# EasyEDA Pro project stiebel_eltron_bus_extension_pcb.eprj, schematic stiebel_can_sniffer
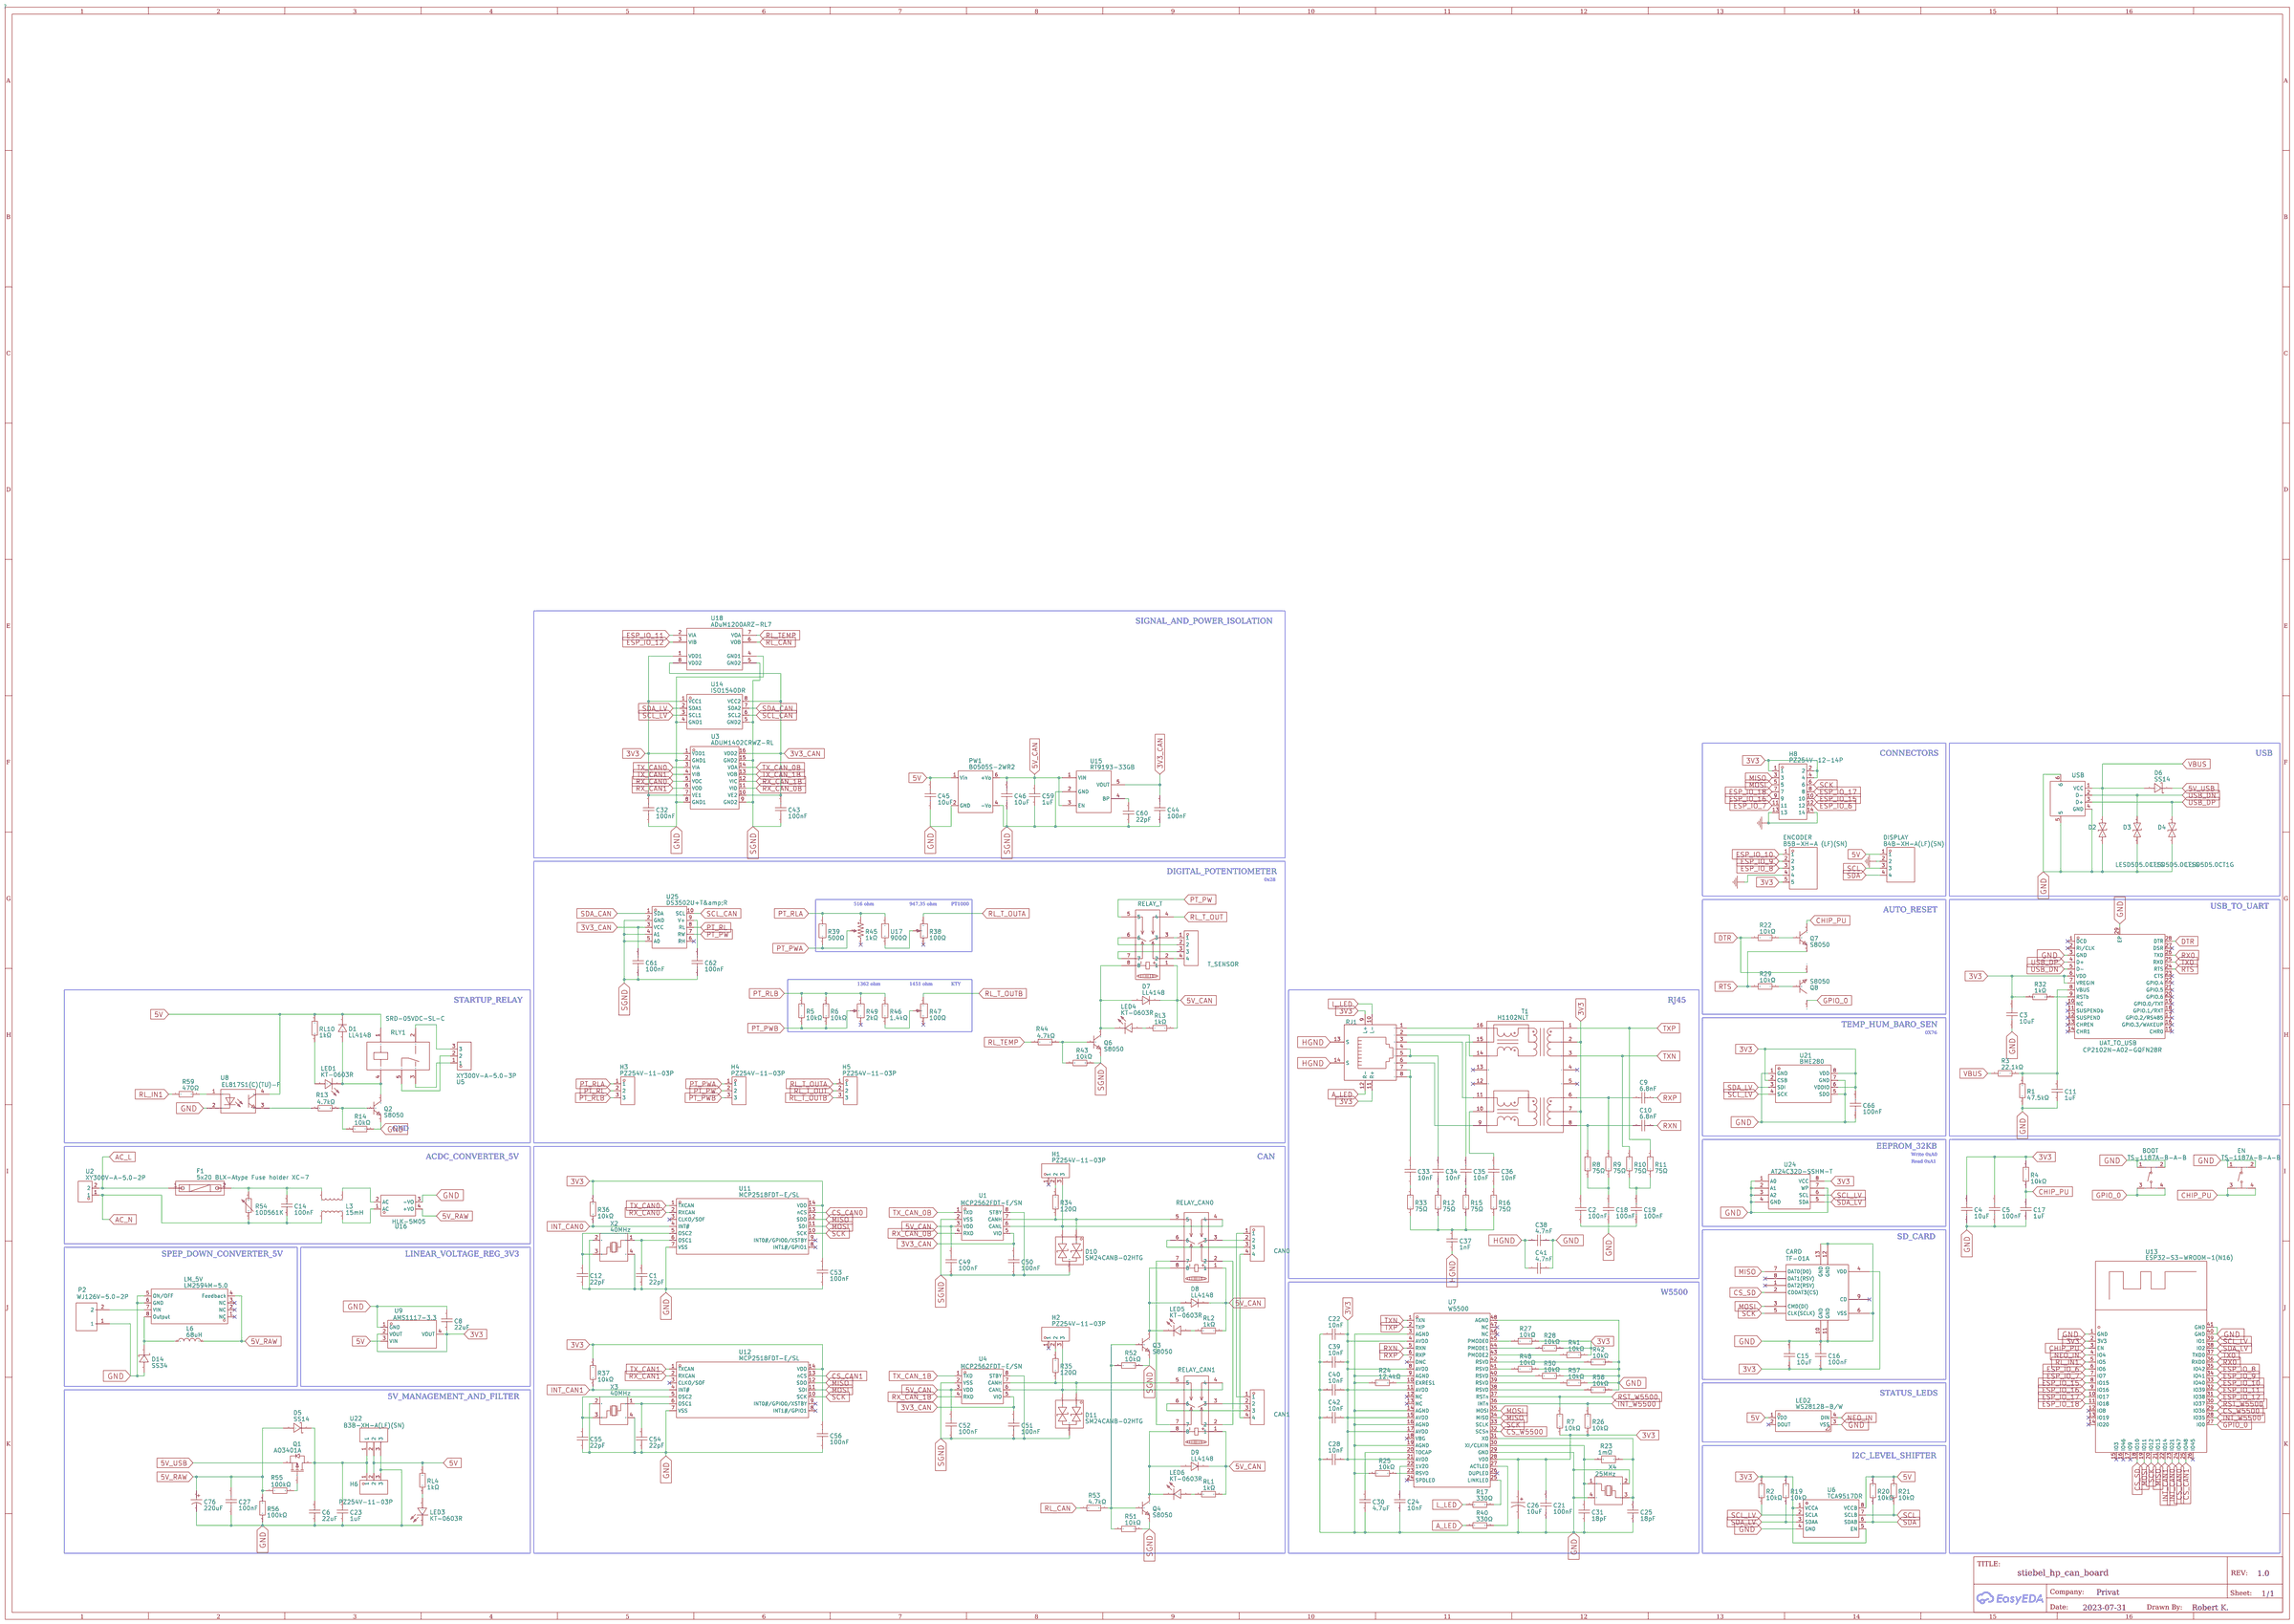
[diagram p0: schematic sheet]

## Parts
BOOT  TS-1187A-B-A-B  [SW-SMD_4P-L5.1-W5.1-P3.70-LS6.5-TL-2]
C1  22pF  [C0603]
C2  100nF  [C0603]  (no BOM)
C3  10uF  [C0603]
C4  10uF  [C0603]
C5  100nF  [C0603]
C6  22uF  [C1206]
C8  22uF  [C1206]
C9  6.8nF  [C0603]
C10  6.8nF  [C0603]
C11  1uF  [C0603]
C12  22pF  [C0603]
C14  100nF  [CAP-TH_L13.0-W6.0-P10.00-D1.2]
C15  10uF  [C0603]
C16  100nF  [C0603]
C17  1uF  [C0603]
C18  100nF  [C0603]  (no BOM)
C19  100nF  [C0603]  (no BOM)
C21  100nF  [C0603]
C22  10nF  [C0603]
C23  1uF  [C0603]
C24  10nF  [C0603]
C25  18pF  [C0603]
C26  10uF  [CAP-SMD_BD4.0-L4.3-W4.3-LS5.3-FD]
C27  100nF  [C0603]
C28  10nF  [C0603]
C30  4.7uF  [C0603]
C31  18pF  [C0603]
C32  100nF  [C0603]
C33  10nF  [C0603]
C34  10nF  [C0603]
C35  10nF  [C0603]
C36  10nF  [C0603]
C37  1nF  [C1206]
C38  4.7nF  [C1206]
C39  10nF  [C0603]
C40  10nF  [C0603]
C41  4.7nF  [C1206]
C42  10nF  [C0603]
C43  100nF  [C0603]
C44  100nF  [C0603]
C45  10uF  [C0603]
C46  10uF  [C0603]
C49  100nF  [C0603]
C50  100nF  [C0603]
C51  100nF  [C0603]
C52  100nF  [C0603]
C53  100nF  [C0603]
C54  22pF  [C0603]
C55  22pF  [C0603]
C56  100nF  [C0603]
C59  1uF  [C0603]
C60  22pF  [C0603]
C61  100nF  [C0603]
C62  100nF  [C0603]
C66  100nF  [C0603]
C76  220uF  [CAP-SMD_BD6.3-L6.6-W6.6-FD]
CAN0  DB127V-5.0-4P-GN-S  [CONN-TH_4P-P5.00_DB127V-5.0-4P-GN-S]
CAN1  DB127V-5.0-4P-GN-S  [CONN-TH_4P-P5.00_DB127V-5.0-4P-GN-S]
CARD  TF-01A  [TF-SMD_TF-01A]
D1  LL4148  [LL-34_L3.5-W1.5-RD]
D2  LESD5D5.0CT1G  [SOD-523_L1.2-W0.8-LS1.6-BI]
D3  LESD5D5.0CT1G  [SOD-523_L1.2-W0.8-LS1.6-BI]
D4  LESD5D5.0CT1G  [SOD-523_L1.2-W0.8-LS1.6-BI]
D5  SS14  [SMA_L4.2-W2.6-LS5.3-RD]
D6  SS14  [SMA_L4.2-W2.6-LS5.3-RD]
D7  LL4148  [LL-34_L3.5-W1.5-RD]
D8  LL4148  [LL-34_L3.5-W1.5-RD]
D9  LL4148  [LL-34_L3.5-W1.5-RD]
D10  SM24CANB-02HTG  [SOT-23-3_L2.9-W1.3-P1.90-LS2.4-BR]
D11  SM24CANB-02HTG  [SOT-23-3_L2.9-W1.3-P1.90-LS2.4-BR]
D14  SS34  [SMA_L4.3-W2.6-LS5.2-RD]
DISPLAY  B4B-XH-A(LF)(SN)  [CONN-TH_B4B-XH-A-LF-SN]
EN  TS-1187A-B-A-B  [SW-SMD_4P-L5.1-W5.1-P3.70-LS6.5-TL-2]
ENCODER  B5B-XH-A (LF)(SN)  [CONN-TH_B5B-XH-A-LF-SN]
F1  5x20 BLX-Atype Fuse holder XC-7  [FUSE-TH_L22.6-W9.0]
H1  PZ254V-11-03P  [HDR-TH_3P-P2.54-V-M]
H2  PZ254V-11-03P  [HDR-TH_3P-P2.54-V-M]
H3  PZ254V-11-03P  [HDR-TH_3P-P2.54-V-M]
H4  PZ254V-11-03P  [HDR-TH_3P-P2.54-V-M]
H5  PZ254V-11-03P  [HDR-TH_3P-P2.54-V-M]
H6  PZ254V-11-03P  [HDR-TH_3P-P2.54-V-M]
H8  PZ254V-12-14P  [HDR-TH_14P-P2.54-V-M-R2-C7-S2.54]
L3  15mH  [FILTER-TH_4P-L17.0-W12.0-P7.00-D0.6-S8.00]
L6  68uH  [IND-SMD_L7.1-W6.6]
LED1  KT-0603R  [LED0603-RD]
LED2  WS2812B-B/W  [LED-SMD_4P-L5.0-W5.0-TL_WS2812B-B]
LED3  KT-0603R  [LED0603-RD]
LED4  KT-0603R  [LED0603-RD]
LED5  KT-0603R  [LED0603-RD]
LED6  KT-0603R  [LED0603-RD]
LM_5V  LM2594M-5.0  [SOP-8_L4.9-W3.9-P1.27-LS6.0-BL]
P2  WJ126V-5.0-2P  [CONN-TH_WJ126V-5.0-2P]
PW1  B0505S-2WR2  [PWRM-TH_B0505S-2WR2_C2992385]
Q1  AO3401A  [SOT-23_L2.9-W1.3-P1.90-LS2.4-BR]
Q2  S8050  [SOT-23-3_L3.0-W1.7-P0.95-LS2.9-BR]
Q3  S8050  [SOT-23-3_L3.0-W1.7-P0.95-LS2.9-BR]
Q4  S8050  [SOT-23-3_L3.0-W1.7-P0.95-LS2.9-BR]
Q6  S8050  [SOT-23-3_L3.0-W1.7-P0.95-LS2.9-BR]
Q7  S8050  [SOT-23-3_L3.0-W1.7-P0.95-LS2.9-BR]
Q8  S8050  [SOT-23-3_L3.0-W1.7-P0.95-LS2.9-BR]
R1  47.5kΩ  [R0603]
R2  10kΩ  [R0603]
R3  22.1kΩ  [R0603]
R4  10kΩ  [R0603]
R5  10kΩ  [R0603]
R6  10kΩ  [R0603]
R7  10kΩ  [R0603]
R8  75Ω  [R0603]
R9  75Ω  [R0603]
R10  75Ω  [R0603]
R11  75Ω  [R0603]
R12  75Ω  [R0603]
R13  4.7kΩ  [R0603]
R14  10kΩ  [R0603]
R15  75Ω  [R0603]
R16  75Ω  [R0603]
R17  330Ω  [R0603]
R19  10kΩ  [R0603]
R20  10kΩ  [R0603]
R21  10kΩ  [R0603]
R22  10kΩ  [R0603]
R23  1mΩ  [RES-SMD_L3.2-W1.6_PA1206]
R24  12.4kΩ  [R0603]
R25  10kΩ  [R0603]
R26  10kΩ  [R0603]
R27  10kΩ  [R0603]
R28  10kΩ  [R0603]
R29  10kΩ  [R0603]
R32  1kΩ  [R0603]
R33  75Ω  [R0603]
R34  120Ω  [R0603]
R35  120Ω  [R0603]
R36  10kΩ  [R0603]
R37  10kΩ  [R0603]
R38  100Ω  [RES-ADJ-TH_3296W]
R39  500Ω  [R0805]
R40  330Ω  [R0603]
R41  10kΩ  [R0603]
R42  10kΩ  [R0603]
R43  10kΩ  [R0603]
R44  4.7kΩ  [R0603]
R45  1kΩ  [RES-ADJ-TH_3P-L10.0-W10.0-P2.50-BL-BS]
R46  1.4kΩ  [R0603]
R47  100Ω  [RES-ADJ-TH_3296W]
R48  10kΩ  [R0603]
R49  2kΩ  [RES-ADJ-TH_3P-L10.0-W10.0-P2.50-BL-BS]
R50  10kΩ  [R0603]
R51  10kΩ  [R0603]
R52  10kΩ  [R0603]
R53  4.7kΩ  [R0603]
R54  10D561K  [RES-TH_L13.0-W6.0-P7.50-D0.9-S6.00]
R55  100kΩ  [R0603]
R56  100kΩ  [R0603]
R57  10kΩ  [R0603]
R58  10kΩ  [R0603]
R59  470Ω  [R0603]
RELAY_CAN0  G6K-2F-Y-DC5  [RELAY-SMD_G6K-2F-X-XX]
RELAY_CAN1  G6K-2F-Y-DC5  [RELAY-SMD_G6K-2F-X-XX]
RELAY_T  G6K-2F-Y-DC5  [RELAY-SMD_G6K-2F-X-XX]
RJ1  R-RJ45R08P-C000  [RJ45-TH_R-RJ45R08P-C000]
RL1  1kΩ  [R0603]
RL2  1kΩ  [R0603]
RL3  1kΩ  [R0603]
RL4  1kΩ  [R0603]
RL10  1kΩ  [R0603]
RLY1  SRD-05VDC-SL-C  [RELAY-TH_SRD-XXVDC-XL-C]
T1  H1102NLT  [XFMR-SMD_H1102NLT]
T_SENSOR  DB127V-5.0-4P-GN-S  [CONN-TH_4P-P5.00_DB127V-5.0-4P-GN-S]
U1  MCP2562FDT-E/SN  [SOIC-8_L4.9-W3.9-P1.27-LS6.0-BL]
U2  XY300V-A-5.0-2P  [CONN-TH_XY300V-A-5.0-2P]
U3  ADUM1402CRWZ-RL  [SOIC-16_L10.3-W7.5-P1.27-LS10.3-TL]
U4  MCP2562FDT-E/SN  [SOIC-8_L4.9-W3.9-P1.27-LS6.0-BL]
U5  XY300V-A-5.0-3P  [CONN-TH_XY300V-A-5.0-3P]
U6  TCA9517DR  [SOIC-8_L4.9-W3.9-P1.27-LS6.0-BL]
U7  W5500  [LQFP-48_L7.0-W7.0-P0.50-LS9.0-BL]
U8  EL817S1(C)(TU)-F  [OPTO-SMD-4_L4.6-W6.5-P2.54-LS10.3-TL]
U9  AMS1117-3.3  [SOT-223-3_L6.5-W3.4-P2.30-LS7.0-BR]
U11  MCP2518FDT-E/SL  [SOIC-14_L8.7-W3.9-P1.27-LS6.0-BL]
U12  MCP2518FDT-E/SL  [SOIC-14_L8.7-W3.9-P1.27-LS6.0-BL]
U13  ESP32-S3-WROOM-1(N16)  [WIRELM-SMD_ESP32-S3-WROOM-1]
U14  ISO1540DR  [SOIC-8_L4.9-W3.9-P1.27-LS6.0-BL]
U15  RT9193-33GB  [SOT-23-5_L3.0-W1.7-P0.95-LS2.8-BL]
U16  HLK-5M05  [PWRM-TH_HLK-5M05]
U17  900Ω  [R0805]
U18  ADuM1200ARZ-RL7  [SOIC-8_L5.0-W4.0-P1.27-LS6.0-BL]
U21  BME280  [LGA-8_BME280_BL]
U22  B3B-XH-A(LF)(SN)  [CONN-TH_3P-P2.50_A2501WV2-3P]
U24  AT24C32D-SSHM-T  [SOIC-8_L5.0-W4.0-P1.27-LS6.0-BL]
U25  DS3502U+T&amp;R  [UMAX-10_L3.0-W3.0-P0.50-LS4.9-BL]
UAT_TO_USB  CP2102N-A02-GQFN28R  [QFN-28_L5.0-W5.0-P0.50-TL-EP3.3]
USB  670688000  [USB-B-TH_67068-8000]
X2  40MHz  [OSC-SMD_4P-L3.2-W2.5-BL_SIT8008BI]
X3  40MHz  [OSC-SMD_4P-L3.2-W2.5-BL_SIT8008BI]
X4  25MHz  [OSC-SMD_4P-L3.2-W2.5-BL]

## Library data of the parts
BOOT EN = TS-1187A-B-A-B: link: https://lcsc.com/eda_search?q=C318884&amp;%26type=1&amp;ref=editor; 3DModel: SW-SMD_4P-L5.2-W5.2-H1.5-LS6.4-P3.70; Supplier: LCSC; Supplier Part: C318884; Manufacturer: XKB Connectivity(中国星坤); JLCPCB Part Class: Basic Part
C1 C12 C54 C55 C60 = 22pF: link: https://lcsc.com/eda_search?q=C1653&amp;%26type=1&amp;ref=editor; 3DModel: C0603_L1.6-W0.8-H0.8; Supplier: LCSC; Manufacturer Part: CL10C220JB8NNNC; Manufacturer: SAMSUNG(三星); Supplier Part: C1653; JLCPCB Part Class: Basic Part
C2 C5 C16 C18 C19 C21 C27 C32 C43 C44 C49-C53 C56 C61 C62 = 100nF: link: https://lcsc.com/eda_search?q=C14663&amp;%26type=1&amp;ref=editor; 3DModel: C0603_L1.6-W0.8-H0.8; Supplier: LCSC; Manufacturer: YAGEO(国巨); Manufacturer Part: CC0603KRX7R9BB104; Supplier Part: C14663; JLCPCB Part Class: Basic Part
C3 C4 C15 C45 C46 = 10uF: link: https://lcsc.com/eda_search?q=C19702&amp;%26type=1&amp;ref=editor; 3DModel: C0603_L1.6-W0.8-H0.8; Supplier: LCSC; Manufacturer: SAMSUNG(三星); Manufacturer Part: CL10A106KP8NNNC; Supplier Part: C19702; JLCPCB Part Class: Basic Part
C6 C8 = 22uF: link: https://lcsc.com/eda_search?q=C12891&amp;%26type=1&amp;ref=editor; 3DModel: C1206_L3.2-W1.6-H1.3; Supplier: LCSC; Manufacturer Part: CL31A226KAHNNNE; Manufacturer: SAMSUNG(三星); Supplier Part: C12891; JLCPCB Part Class: Basic Part
C9 C10 = 6.8nF: link: https://lcsc.com/eda_search?q=C1631&amp;%26type=1&amp;ref=editor; 3DModel: C0603_L1.6-W0.8-H0.8; Supplier: LCSC; Manufacturer: FH(风华); Manufacturer Part: 0603B682K500NT; Supplier Part: C1631; JLCPCB Part Class: Basic Part
C11 C17 C23 C59 = 1uF: link: https://lcsc.com/eda_search?q=C15849&amp;%26type=1&amp;ref=editor; 3DModel: C0603_L1.6-W0.8-H0.8; Supplier: LCSC; Manufacturer Part: CL10A105KB8NNNC; Manufacturer: SAMSUNG(三星); Supplier Part: C15849; JLCPCB Part Class: Basic Part
C14 = 100nF: link: https://lcsc.com/eda_search?q=C270277&amp;%26type=1&amp;ref=editor; 3DModel: CAP-TH_L13.0-W6.0-H12.0-P10.0; Supplier: LCSC; Supplier Part: C270277; Manufacturer: CHAMPION(全鹏); Manufacturer Part: MPP104K1000D131206B1015; JLCPCB Part Class: Extended Part
C22 C24 C28 C39 C40 C42 = 10nF: link: https://lcsc.com/eda_search?q=C57112&amp;%26type=1&amp;ref=editor; 3DModel: C0603_L1.6-W0.8-H0.8; Supplier: LCSC; Manufacturer: FH(风华); Manufacturer Part: 0603B103K500NT; Supplier Part: C57112; JLCPCB Part Class: Basic Part
C25 C31 = 18pF: link: https://lcsc.com/eda_search?q=C1647&amp;%26type=1&amp;ref=editor; 3DModel: C0603_L1.6-W0.8-H0.8; Supplier: LCSC; Manufacturer Part: CL10C180JB8NNNC; Manufacturer: SAMSUNG(三星); Supplier Part: C1647; JLCPCB Part Class: Basic Part
C26 = 10uF: link: https://lcsc.com/eda_search?q=C445047&amp;%26type=1&amp;ref=editor; Supplier: LCSC; Supplier Part: C445047; Manufacturer: Nichicon(尼吉康); Manufacturer Part: UWX1C100MCL1GB; JLCPCB Part Class: Extended Part
C30 = 4.7uF: link: https://lcsc.com/eda_search?q=C19666&amp;%26type=1&amp;ref=editor; 3DModel: C0603_L1.6-W0.8-H0.8; Supplier: LCSC; Manufacturer Part: CL10A475KO8NNNC; Manufacturer: SAMSUNG(三星); Supplier Part: C19666; JLCPCB Part Class: Basic Part
C33-C36 = 10nF: link: https://lcsc.com/eda_search?q=C302008&amp;%26type=1&amp;ref=editor; 3DModel: C0603_L1.6-W0.8-H0.8; Supplier: LCSC; Supplier Part: C302008; Manufacturer: Walsin(华新科); Manufacturer Part: 0603B103K101CT; JLCPCB Part Class: Extended Part
C37 = 1nF: link: https://lcsc.com/eda_search?q=C9196&amp;%26type=1&amp;ref=editor; 3DModel: C1206_L3.2-W1.6-H1.3; Supplier: LCSC; Manufacturer: FH(风华); Manufacturer Part: 1206B102K202NT; Supplier Part: C9196; JLCPCB Part Class: Basic Part
C38 C41 = 4.7nF: link: https://lcsc.com/eda_search?q=C41017&amp;%26type=1&amp;ref=editor; 3DModel: C1206_L3.2-W1.6-H1.3; Supplier: LCSC; Manufacturer: FH(风华); Manufacturer Part: 1206B472K202NT; Supplier Part: C41017; JLCPCB Part Class: Extended Part
C66 = 100nF: link: https://lcsc.com/eda_search?q=C14663&%26type=1&ref=editor; 3DModel: C0603_L1.6-W0.8-H0.8; Supplier: LCSC; Manufacturer: YAGEO(国巨); Manufacturer Part: CC0603KRX7R9BB104; Supplier Part: C14663; JLCPCB Part Class: Basic Part
C76 = 220uF: link: https://item.szlcsc.com/265679.html; Supplier: LCSC; Supplier Part: C267466; Manufacturer: ROQANG(容强); Manufacturer Part: RT1A221M0605; JLCPCB Part Class: Extended Part
CAN0 CAN1 T_SENSOR = DB127V-5.0-4P-GN-S: link: https://lcsc.com/eda_search?q=C430624&amp;%26type=1&amp;ref=editor; Supplier: LCSC; Supplier Part: C430624; Manufacturer: DIBO(地博电气); JLCPCB Part Class: Extended Part
CARD = TF-01A: link: https://item.szlcsc.com/92334.html; 3DModel: TF-SMD_L14.8-W14.5-H1.9-P1.1; Supplier: LCSC; Manufacturer: 韩国韩荣; Supplier Part: C91145; JLCPCB Part Class: Extended Part
D1 D7-D9 = LL4148: link: https://lcsc.com/eda_search?q=C9808&amp;%26type=1&amp;ref=editor; 3DModel: LL-34_L3.5-W1.5; Supplier: LCSC; Manufacturer: ST(先科); Supplier Part: C9808; JLCPCB Part Class: Basic Part
D2-D4 = LESD5D5.0CT1G: link: https://lcsc.com/eda_search?q=C383211&amp;%26type=1&amp;ref=editor; Supplier: LCSC; Supplier Part: C383211; Manufacturer: LRC(乐山无线电); JLCPCB Part Class: Extended Part
D5 D6 = SS14: link: https://lcsc.com/eda_search?q=C2480&amp;%26type=1&amp;ref=editor; Supplier: LCSC; Manufacturer: MDD; Supplier Part: C2480; JLCPCB Part Class: Basic Part
D10 D11 = SM24CANB-02HTG: link: https://lcsc.com/eda_search?q=C151237&amp;%26type=1&amp;ref=editor; 3DModel: SOT-23-3P_L2.9-W1.3-H1.0-LS2.4-P0.95; Supplier: LCSC; Supplier Part: C151237; Manufacturer: Littelfuse(美国力特); JLCPCB Part Class: Extended Part
D14 = SS34: link: https://item.szlcsc.com/34721.html; Supplier: LCSC; Manufacturer: MDD; Supplier Part: C8678; JLCPCB Part Class: Basic Part
DISPLAY = B4B-XH-A(LF)(SN): link: https://lcsc.com/eda_search?q=C144395&amp;%26type=1&amp;ref=editor; 3DModel: XH2.5-4A; Supplier: LCSC; Supplier Part: C144395; Manufacturer: JST; JLCPCB Part Class: Extended Part
ENCODER = B5B-XH-A (LF)(SN): link: https://lcsc.com/eda_search?q=C157991&amp;%26type=1&amp;ref=editor; 3DModel: CONN-TH_XH2.50-LI-5P; Supplier: LCSC; Supplier Part: C157991; Manufacturer: JST; Manufacturer Part: B5B-XH-A(LF)(SN); JLCPCB Part Class: Extended Part
F1 = 5x20 BLX-Atype Fuse holder XC-7: link: https://lcsc.com/eda_search?q=C3131&amp;%26type=1&amp;ref=editor; Supplier: LCSC; Manufacturer Part: 5x20 BLX-A型 保险丝支架 XC-7; Manufacturer: xcfuse(旭程); Supplier Part: C3131; JLCPCB Part Class: Extended Part
H1-H6 = PZ254V-11-03P: link: https://lcsc.com/eda_search?q=C2937625&amp;%26type=1&amp;ref=editor; 3DModel: HDR-TH_3P-P2.54-M-LI-1X3P; Supplier: LCSC; Supplier Part: C2937625; Manufacturer: XFCN(兴飞); JLCPCB Part Class: Extended Part
H8 = PZ254V-12-14P: link: https://lcsc.com/eda_search?q=C492424&amp;%26type=1&amp;ref=editor; 3DModel: HDR-TH_14P-P2.54-M-LI-2X7P; Supplier: LCSC; Supplier Part: C492424; Manufacturer: XFCN(兴飞); JLCPCB Part Class: Extended Part
L3 = 15mH: link: https://lcsc.com/eda_search?q=C75194&amp;%26type=1&amp;ref=editor; 3DModel: FILTER-TH_4P-L17.0-W12.0-H16.5-P7.00-D0.6-S8.00; Supplier: LCSC; Manufacturer: FH(风华); Manufacturer Part: UU9.8-15mH; Supplier Part: C75194; JLCPCB Part Class: Extended Part
L6 = 68uH: link: https://item.szlcsc.com/421431.html; 3DModel: IND-SMD_L6.6-W7.1-H3.0; Supplier: LCSC; Supplier Part: C2894721; Manufacturer: SXN(顺翔诺); Manufacturer Part: SMMS0650-680M; JLCPCB Part Class: Extended Part
LED1 LED3-LED6 = KT-0603R: link: https://lcsc.com/eda_search?q=C2286&amp;%26type=1&amp;ref=editor; Supplier: LCSC; Manufacturer: KENTO; Supplier Part: C2286; JLCPCB Part Class: Basic Part
LED2 = WS2812B-B/W: link: https://lcsc.com/eda_search?q=C2761795&amp;%26type=1&amp;ref=editor; 3DModel: LED-SMD_4P-L5.0-W5.0-H1.57-TL_WS2812B-B; Supplier: LCSC; Supplier Part: C2761795; Manufacturer: worldsemi; Manufacturer Part: WS2812B-B/T; JLCPCB Part Class: Extended Part
LM_5V = LM2594M-5.0: link: https://item.szlcsc.com/383602.html; 3DModel: SOP-8_L4.9-W3.9-P1.27-LS6.0-BL-1; Supplier: LCSC; Supplier Part: C2904795; Manufacturer: UMW(广东友台半导体); JLCPCB Part Class: Extended Part
P2 = WJ126V-5.0-2P: link: https://lcsc.com/eda_search?q=C8404&amp;%26type=1&amp;ref=editor; 3DModel: CONN-TH_DB5.00-LI-2P-126; Supplier: LCSC; Manufacturer: KANGNEX(康奈克斯电气); Supplier Part: C8404; JLCPCB Part Class: Extended Part
PW1 = B0505S-2WR2: link: https://lcsc.com/eda_search?q=C2992385&amp;%26type=1&amp;ref=editor; Supplier: LCSC; Supplier Part: C2992385; Manufacturer: YLPTEC(易川); JLCPCB Part Class: Extended Part
Q1 = AO3401A: link: https://lcsc.com/eda_search?q=C15127&amp;%26type=1&amp;ref=editor; 3DModel: SOT-23-3P_L2.9-W1.3-H1.0-LS2.4-P0.95; Supplier: LCSC; Manufacturer: AOS; Supplier Part: C15127; JLCPCB Part Class: Basic Part
Q2-Q4 Q6-Q8 = S8050: link: https://lcsc.com/eda_search?q=C2146&amp;%26type=1&amp;ref=editor; 3DModel: SOT-23-3L_L2.9-W1.6-H1.1-LS2.8-P0.95; Supplier: LCSC; Manufacturer: CJ(江苏长电/长晶); Manufacturer Part: S8050 J3Y; Supplier Part: C2146; JLCPCB Part Class: Basic Part
R1 = 47.5kΩ: link: https://lcsc.com/eda_search?q=C23061&amp;%26type=1&amp;ref=editor; Supplier: LCSC; Manufacturer: UNI-ROYAL(厚声); Manufacturer Part: 0603WAF4752T5E; Supplier Part: C23061; JLCPCB Part Class: Extended Part
R2 R4-R7 R19-R22 R25-R29 R36 R37 R41 R42 R48 R50 R57 R58 = 10kΩ: link: https://lcsc.com/eda_search?q=C25804&amp;%26type=1&amp;ref=editor; Supplier: LCSC; Manufacturer: UNI-ROYAL(厚声); Manufacturer Part: 0603WAF1002T5E; Supplier Part: C25804; JLCPCB Part Class: Basic Part
R3 = 22.1kΩ: link: https://lcsc.com/eda_search?q=C25961&amp;%26type=1&amp;ref=editor; Supplier: LCSC; Manufacturer: UNI-ROYAL(厚声); Manufacturer Part: 0603WAF2212T5E; Supplier Part: C25961; JLCPCB Part Class: Extended Part
R8-R12 R15 R16 R33 = 75Ω: link: https://lcsc.com/eda_search?q=C4275&amp;%26type=1&amp;ref=editor; Supplier: LCSC; Manufacturer: UNI-ROYAL(厚声); Manufacturer Part: 0603WAF750JT5E; Supplier Part: C4275; JLCPCB Part Class: Basic Part
R13 R44 R53 = 4.7kΩ: link: https://www.mouser.in/datasheet/2/447/PYu_RT_1_to_0_01_RoHS_L_11-1669912.pdf; Supplier: LCSC; Manufacturer: UNI-ROYAL(厚声); Manufacturer Part: 0603WAF4701T5E; Supplier Part: C23162; Resistance: 4.7K; JLCPCB Part Class: Basic Part
R14 R43 R51 R52 = 10kΩ: link: https://lcsc.com/eda_search?q=C25804&%26type=1&ref=editor; Supplier: LCSC; Manufacturer: UNI-ROYAL(厚声); Manufacturer Part: 0603WAF1002T5E; Supplier Part: C25804; JLCPCB Part Class: Basic Part
R17 R40 = 330Ω: link: https://lcsc.com/eda_search?q=C23138&amp;%26type=1&amp;ref=editor; Supplier: LCSC; Manufacturer: UNI-ROYAL(厚声); Manufacturer Part: 0603WAF3300T5E; Supplier Part: C23138; JLCPCB Part Class: Basic Part
R23 = 1mΩ: link: https://lcsc.com/eda_search?q=C914835&amp;%26type=1&amp;ref=editor; Supplier: LCSC; Supplier Part: C914835; Manufacturer: YAGEO(国巨); Manufacturer Part: PA1206FRF470R001Z; JLCPCB Part Class: Extended Part
R24 = 12.4kΩ: link: https://lcsc.com/eda_search?q=C22865&amp;%26type=1&amp;ref=editor; Supplier: LCSC; Manufacturer: UNI-ROYAL(厚声); Manufacturer Part: 0603WAF1242T5E; Supplier Part: C22865; JLCPCB Part Class: Extended Part
R32 = 1kΩ: link: https://lcsc.com/eda_search?q=C21190&amp;%26type=1&amp;ref=editor; Supplier: LCSC; Manufacturer: UNI-ROYAL(厚声); Manufacturer Part: 0603WAF1001T5E; Supplier Part: C21190; JLCPCB Part Class: Basic Part
R34 R35 = 120Ω: link: https://lcsc.com/eda_search?q=C22787&amp;%26type=1&amp;ref=editor; Supplier: LCSC; Manufacturer: UNI-ROYAL(厚声); Manufacturer Part: 0603WAF1200T5E; Supplier Part: C22787; JLCPCB Part Class: Basic Part
R38 R47 = 100Ω: link: https://lcsc.com/eda_search?q=C83688&amp;%26type=1&amp;ref=editor; Resistance: 100; Supplier: LCSC; Manufacturer: BOURNS; Manufacturer Part: 3296W-1-101LF; Supplier Part: C83688; JLCPCB Part Class: Extended Part
R39 = 500Ω: link: https://lcsc.com/eda_search?q=C2828857&amp;%26type=1&amp;ref=editor; 3DModel: R0805_L2.0-W1.3-H0.6; Supplier: LCSC; Supplier Part: C2828857; Manufacturer: Viking(光颉); Manufacturer Part: ARG05FTC5000; JLCPCB Part Class: Extended Part
R45 = 1kΩ: link: https://lcsc.com/eda_search?q=C118949&amp;%26type=1&amp;ref=editor; 3DModel: 3296W; Resistance: 1K; Supplier: LCSC; Supplier Part: C118949; Manufacturer: BOCHEN(博晨); Manufacturer Part: 3296W-1-102; JLCPCB Part Class: Extended Part
R46 = 1.4kΩ: link: https://lcsc.com/eda_search?q=C185359&amp;%26type=1&amp;ref=editor; Supplier: LCSC; Supplier Part: C185359; Manufacturer: YAGEO(国巨); Manufacturer Part: RC0603FR-071K4L; JLCPCB Part Class: Extended Part
R49 = 2kΩ: link: https://lcsc.com/eda_search?q=C118206&amp;%26type=1&amp;ref=editor; 3DModel: 3296W; Resistance: 2K; Supplier: LCSC; Manufacturer: BOCHEN(博晨); Manufacturer Part: 3296W-1-202; Supplier Part: C118206; JLCPCB Part Class: Extended Part
R54 = 10D561K: link: https://lcsc.com/eda_search?q=C113236&amp;%26type=1&amp;ref=editor; 3DModel: RES-TH_L12.0-W6.0-H15.0-P7.50-D0.8-S6.00; Supplier: LCSC; Manufacturer: HEL(鸿志); Supplier Part: C113236; JLCPCB Part Class: Extended Part
R55 R56 = 100kΩ: link: https://lcsc.com/eda_search?q=C25803&amp;%26type=1&amp;ref=editor; Supplier: LCSC; Manufacturer: UNI-ROYAL(厚声); Manufacturer Part: 0603WAF1003T5E; Supplier Part: C25803; JLCPCB Part Class: Basic Part
R59 = 470Ω: link: https://lcsc.com/eda_search?q=C23179&amp;%26type=1&amp;ref=editor; Supplier: LCSC; Manufacturer: UNI-ROYAL(厚声); Manufacturer Part: 0603WAF4700T5E; Supplier Part: C23179; JLCPCB Part Class: Basic Part
RELAY_CAN0 RELAY_CAN1 RELAY_T = G6K-2F-Y-DC5: link: https://lcsc.com/eda_search?q=C47190&amp;%26type=1&amp;ref=editor; 3DModel: SMD-8_L10.0-W6.5-H5.4-LS7.8-P2.2-3.2; Supplier: LCSC; Manufacturer: OMRON(欧姆龙); Manufacturer Part: G6K-2F-Y-TR DC5; Supplier Part: C47190; JLCPCB Part Class: Extended Part
RJ1 = R-RJ45R08P-C000: link: https://lcsc.com/eda_search?q=C386757&amp;%26type=1&amp;ref=editor; 3DModel: RJ45-TH_L16.3-W15.8-H13.1; Supplier: LCSC; Supplier Part: C386757; Manufacturer: Ckmtw(灿科盟); JLCPCB Part Class: Extended Part
RL1-RL4 RL10 = 1kΩ: link: https://lcsc.com/eda_search?q=C21190&%26type=1&ref=editor; Supplier: LCSC; Manufacturer: UNI-ROYAL(厚声); Manufacturer Part: 0603WAF1001T5E; Supplier Part: C21190; JLCPCB Part Class: Basic Part
RLY1 = SRD-05VDC-SL-C: link: https://item.szlcsc.com/31188.html; 3DModel: RELAY-TH_L19.2-W15.6-H15.8; Supplier: LCSC; Manufacturer: 松乐; Supplier Part: C35449; JLCPCB Part Class: Extended Part
T1 = H1102NLT: link: https://lcsc.com/eda_search?q=C18584&amp;%26type=1&amp;ref=editor; 3DModel: XFMR-SMD_L12.7-W7.1-H6.4-LS9.5-P1.27; Supplier: LCSC; Manufacturer: PULSE; Supplier Part: C18584; JLCPCB Part Class: Extended Part
U1 U4 = MCP2562FDT-E/SN: 3DModel: SOIC-8_L4.9-W3.9-H1.7-LS6.0-P1.27; link: https://lcsc.com/eda_search?q=C511335&amp;%26type=1&amp;ref=editor; Supplier: LCSC; Supplier Part: C511335; Manufacturer: MICROCHIP(美国微芯); JLCPCB Part Class: Extended Part
U2 = XY300V-A-5.0-2P: link: https://lcsc.com/eda_search?q=C557648&amp;%26type=1&amp;ref=editor; Supplier: LCSC; Supplier Part: C557648; Manufacturer: XINLAIYA(新莱亚); JLCPCB Part Class: Extended Part
U3 = ADUM1402CRWZ-RL: link: https://lcsc.com/eda_search?q=C403649&amp;%26type=1&amp;ref=editor; 3DModel: SOIC-16_L10.3-W7.5-H2.7-LS10.3-P1.27; Supplier: LCSC; Supplier Part: C403649; Manufacturer: ADI(亚德诺)/LINEAR(凌特); JLCPCB Part Class: Extended Part
U5 = XY300V-A-5.0-3P: link: https://lcsc.com/eda_search?q=C880594&amp;%26type=1&amp;ref=editor; Supplier: LCSC; Supplier Part: C880594; Manufacturer: XINLAIYA(新莱亚); JLCPCB Part Class: Extended Part
U6 = TCA9517DR: 3DModel: SOIC-8_L4.9-W3.9-H1.7-LS6.0-P1.27; link: https://so.szlcsc.com/global.html?c=&k=C9843; Supplier: LCSC; Manufacturer: TI(德州仪器); Supplier Part: C182421; JLCPCB Part Class: Extended Part
U7 = W5500: link: https://lcsc.com/eda_search?q=C32843&amp;%26type=1&amp;ref=editor; Supplier Part: C32843; Supplier: LCSC; 3DModel: LQFP-48_L7.0-W7.0-H1.4-LS9.0-P0.50; Manufacturer: WIZNET; JLCPCB Part Class: Extended Part
U8 = EL817S1(C)(TU)-F: link: https://lcsc.com/eda_search?q=C106900&amp;%26type=1&amp;ref=editor; 3DModel: OPTO-SMD-4_L4.6-W6.5-H3.6-LS10.2-P2.54; Supplier: LCSC; Manufacturer: EVERLIGHT(亿光); Supplier Part: C106900; JLCPCB Part Class: Basic Part
U9 = AMS1117-3.3: link: https://lcsc.com/eda_search?q=C6186&amp;%26type=1&amp;ref=editor; 3DModel: SOT-223-4P_L6.5-W3.5-H1.6-LS7.0-P2.30; Supplier: LCSC; Manufacturer: AMS; Supplier Part: C6186; JLCPCB Part Class: Basic Part
U11 U12 = MCP2518FDT-E/SL: link: https://lcsc.com/eda_search?q=C626758&amp;%26type=1&amp;ref=editor; 3DModel: SOIC-14_L8.6-W3.9-H1.8-LS6.0-P1.27; Supplier: LCSC; Supplier Part: C626758; Manufacturer: MICROCHIP(美国微芯); JLCPCB Part Class: Extended Part
U13 = ESP32-S3-WROOM-1(N16): link: https://atta.szlcsc.com/upload/public/pdf/source/20220628/A2AC12B3C87735CAEB7EBE2DBE80936C.pdf; Supplier: LCSC; Supplier Part: C2913199; Manufacturer: ESPRESSIF(乐鑫); Manufacturer Part: ESP32-S3-WROOM-1-N16; JLCPCB Part Class: Extended Part
U14 = ISO1540DR: 3DModel: SOIC-8_L4.9-W3.9-H1.7-LS6.0-P1.27; link: https://lcsc.com/eda_search?q=C179739&amp;%26type=1&amp;ref=editor; Supplier: LCSC; Manufacturer: TI(德州仪器); Supplier Part: C179739; JLCPCB Part Class: Extended Part
U15 = RT9193-33GB: link: https://lcsc.com/eda_search?q=C15651&amp;%26type=1&amp;ref=editor; 3DModel: SOT-23-5_L2.9-W1.6-H1.1-LS2.8-P0.95; Supplier: LCSC; Manufacturer: RICHTEK(立锜); Supplier Part: C15651; JLCPCB Part Class: Extended Part
U16 = HLK-5M05: link: https://lcsc.com/eda_search?q=C209907&amp;%26type=1&amp;ref=editor; Supplier: LCSC; Supplier Part: C209907; Manufacturer: HI-LINK(海凌科); JLCPCB Part Class: Extended Part
U17 = 900Ω: link: https://lcsc.com/eda_search?q=C2828704&amp;%26type=1&amp;ref=editor; 3DModel: R0805_L2.0-W1.3-H0.6; Supplier: LCSC; Supplier Part: C2828704; Manufacturer: Viking(光颉); Manufacturer Part: ARG05BTC9000N; JLCPCB Part Class: Extended Part
U18 = ADuM1200ARZ-RL7: link: https://lcsc.com/eda_search?q=C15219&amp;%26type=1&amp;ref=editor; 3DModel: SOIC-8_L4.9-W3.9-H1.7-LS6.0-P1.27; Supplier: LCSC; Manufacturer: ADI(亚德诺)/LINEAR(凌特); Supplier Part: C15219; JLCPCB Part Class: Extended Part
U21 = BME280: link: https://item.szlcsc.com/93682.html; 3DModel: LGA-8_L2.5-W2.5-H0.9-P0.65; Supplier: LCSC; Manufacturer: Bosch(博世); Supplier Part: C92489; JLCPCB Part Class: Extended Part
U22 = B3B-XH-A(LF)(SN): link: https://lcsc.com/eda_search?q=C144394&amp;%26type=1&amp;ref=editor; Supplier: LCSC; Supplier Part: C144394; Manufacturer: JST; JLCPCB Part Class: Extended Part
U24 = AT24C32D-SSHM-T: link: https://item.szlcsc.com/417287.html; 3DModel: SOIC-8_L4.9-W3.9-H1.7-LS6.0-P1.27; Supplier: LCSC; Manufacturer: MICROCHIP; Supplier Part: C60583; JLCPCB Part Class: Extended Part
U25 = DS3502U+T&R: link: https://item.szlcsc.com/1634596.html; Supplier: LCSC; Supplier Part: C2649363; Manufacturer: MAXIM(美信); JLCPCB Part Class: Extended Part
UAT_TO_USB = CP2102N-A02-GQFN28R: link: https://lcsc.com/eda_search?q=C964632&amp;%26type=1&amp;ref=editor; 3DModel: QFN-28_L5.0-W5.0-H0.9-P0.50; Supplier: LCSC; Supplier Part: C964632; Manufacturer: SILICON LABS(芯科); JLCPCB Part Class: Extended Part
USB = 670688000: link: https://lcsc.com/eda_search?q=C114097&amp;%26type=1&amp;ref=editor; Supplier: LCSC; Supplier Part: C114097; Manufacturer: MOLEX; JLCPCB Part Class: Extended Part
X2 X3 = 40MHz: link: https://lcsc.com/eda_search?q=C9010&amp;%26type=1&amp;ref=editor; 3DModel: OSC-SMD_4P-L3.2-W2.5-H1.0; Supplier: LCSC; Manufacturer: YXC(扬兴晶振); Manufacturer Part: X322540MPB4SI; Supplier Part: C9010; JLCPCB Part Class: Extended Part
X4 = 25MHz: link: https://lcsc.com/eda_search?q=C9006&amp;%26type=1&amp;ref=editor; 3DModel: OSC-SMD_4P-L3.2-W2.5-H1.0; Supplier: LCSC; Manufacturer: YXC(扬兴晶振); Manufacturer Part: X322525MOB4SI; Supplier Part: C9006; JLCPCB Part Class: Basic Part

## Nets
3V3: C2.2 C3.2 C4.2 C5.2 C8.2 C15.1 C16.1 C21.2 C22.1 C26.1 C28.1 C32.2 C39.1 C40.1 C42.1 C53.2 C56.2 C66.2 CARD.4(VDD) ENCODER.5 H8.1 H8.2 H8.4 R2.2 R4.1 R7.1 R19.2 R26.1 R27.1 R28.1 R32.2 R36.2 R37.2 R41.1 RJ1.9(L+) RJ1.11(R+) T1.2 T1.7 U3.1(VDD1) U3.7(VE1) U6.1(VCCA) U6.5(EN) U7.4(AVDD) U7.8(AVDD) U7.11(AVDD) U7.15(AVDD) U7.17(AVDD) U7.21(AVDD) U7.28(VDD) U9.2(VOUT) U9.4(VOUT) U11.14(VDD) U12.14(VDD) U13.2(3V3) U14.1(VCC1) U18.1(VDD1) U21.2(CSB) U21.6(VDDIO) U21.8(VDD) U24.8(VCC) UAT_TO_USB.6(VDD) UAT_TO_USB.7(VREGIN)
3V3_CAN: C43.2 C44.2 C50.2 C51.2 C61.2 U1.5(VIO) U3.10(VE2) U3.16(VDD2) U4.5(VIO) U14.8(VCC2) U15.5(VOUT) U18.8(VDD2) U25.3(VCC)
5V: C45.2 D1.1(K) DISPLAY.1 H6.2 LED2.1(VDD) PW1.1(Vin) R20.2 R21.2 RL4.1 RL10.2 RLY1.1 U6.8(VCCB) U8.4(COL) U9.3(VIN) U22.2
5V_CAN: C46.2 C49.2 C52.2 C59.2 D7.1(K) D8.1(K) D9.1(K) PW1.6(+Vo) RELAY_CAN0.1 RELAY_CAN1.1 RELAY_T.1 RL1.1 RL2.1 RL3.1 U1.3(VDD) U4.3(VDD) U15.1(VIN) U15.3(EN)
5V_RAW: C27.2 C76.1 D5.2(A) L6.1 LM_5V.4(Feedback) R55.1 R56.2 U16.4(+VO)
5V_USB: D6.1(K) Q1.2(S)
GND: BOOT.1(A) BOOT.2(B) C1.1 C3.1 C4.1 C5.1 C6.1 C8.1 C11.1 C12.1 C15.2 C16.2 C17.1 C18.1 C21.1 C22.2 C23.1 C24.2 C25.1 C26.2 C27.1 C28.2 C30.1 C31.1 C32.1 C38.2 C39.2 C40.2 C41.2 C42.2 C45.1 C53.1 C54.1 C55.1 C56.1 C66.1 C76.2 CARD.6(VSS) CARD.10(GND) CARD.11(GND) CARD.12(GND) CARD.13(GND) D2.1 D3.1 D4.1 D14.2(A) DISPLAY.2 EN.1(A) EN.2(B) ENCODER.4 H6.3 H8.13 H8.14 LED2.3(VSS) LED3.1(K) LM_5V.5(ON/OFF) LM_5V.6(GND) P2.1 PW1.2(GND) Q2.2(E) R1.1 R14.1 R24.1 R25.1 R42.1 R48.1 R50.1 R56.1 R57.1 R58.1 U3.2(GND1) U3.8(GND1) U6.4(GND) U7.3(AGND) U7.9(AGND) U7.14(AGND) U7.16(AGND) U7.19(AGND) U7.29(GND) U7.48(AGND) U8.2(CAT) U9.1(GND) U11.7(VSS) U12.7(VSS) U13.1(GND) U13.40(GND) U13.41(GND) U14.4(GND1) U16.3(-VO) U18.4(GND1) U21.1(GND) U21.5(SDO) U21.7(GND) U22.3 U24.1(A0) U24.2(A1) U24.3(A2) U24.4(GND) U24.7(WP) UAT_TO_USB.3(GND) UAT_TO_USB.29(EP) USB.4(GND) USB.5 USB.6 X2.2(GND) X2.4(GND) X3.2(GND) X3.4(GND) X4.2(GND) X4.4(GND)
SGND: C43.1 C44.1 C46.1 C49.1 C50.1 C51.1 C52.1 C59.1 C60.1 C61.1 C62.1 D10.3 D11.3 PW1.4(-Vo) Q3.2(E) Q4.2(E) Q6.2(E) R43.1 R51.1 R52.1 U1.2(VSS) U1.8(STBY) U3.9(GND2) U3.15(GND2) U4.2(VSS) U4.8(STBY) U14.5(GND2) U15.2(GND) U18.5(GND2) U25.2(GND) U25.4(A1) U25.5(A0)
VBUS: D2.2 D6.2(A) R3.1 USB.1(VCC)
A_LED: R40.1 RJ1.12(R-)
AC_L: F1.1 U2.2
AC_N: C14.1 L3.2 R54.1 U2.1
CHIP_PU: C17.2 EN.3(C) EN.4(D) Q7.3(C) R4.2 U13.3(EN)
CS_CAN0: U11.13(nCS) U13.24(IO47)
CS_CAN1: U12.13(nCS) U13.25(IO48)
CS_SD: CARD.2(CDDAT3(CS)) U13.18(IO10)
CS_W5500: U7.32(SCSn) U13.29(IO36)
DTR: Q8.2(E) R22.2 UAT_TO_USB.28(DTR)
ESP_IO_6: H8.12 U13.6(IO6)
ESP_IO_7: H8.11 U13.7(IO7)
ESP_IO_8: ENCODER.3 U13.35(IO42)
ESP_IO_9: ENCODER.2 U13.34(IO41)
ESP_IO_10: ENCODER.1 U13.33(IO40)
ESP_IO_11: U13.32(IO39) U18.2(VIA)
ESP_IO_12: U13.31(IO38) U18.3(VIB)
ESP_IO_15: H8.10 U13.8(IO15)
ESP_IO_16: H8.9 U13.9(IO16)
ESP_IO_17: H8.8 U13.10(IO17)
ESP_IO_18: H8.7 U13.11(IO18)
GPIO_0: BOOT.3(C) BOOT.4(D) Q8.3(C) U13.27(IO0)
HGND: C37.1 C38.1 C41.1 RJ1.13(S) RJ1.14(S)
INT_CAN0: R36.1 U11.4(INT#) U13.23(IO21)
INT_CAN1: R37.1 U12.4(INT#) U13.22(IO14)
INT_W5500: R26.2 U7.36(INTn) U13.28(IO35)
L_LED: R17.1 RJ1.10(L-)
MISO: CARD.7(DAT0(D0)) H8.3 U7.34(MISO) U11.12(SDO) U12.12(SDO) U13.21(IO13)
MOSI: CARD.3(CMD(DI)) H8.5 U7.35(MOSI) U11.11(SDI) U12.11(SDI) U13.19(IO11)
NEO_IN: LED2.4(DIN) U13.4(IO4)
PT_PW: H4.2 RELAY_T.5 U25.7(RW)
PT_PWA: H4.1 R39.1 R45.2
PT_PWB: H4.3 R5.1 R6.1 R49.2
PT_RL: H3.2 U25.8(RL)
PT_RLA: H3.1 R39.2 R45.1 U17.1
PT_RLB: H3.3 R5.2 R6.2 R46.2 R49.1
RL_CAN: R53.1 U18.6(VOB)
RL_IN1: R59.1 U13.5(IO5)
RL_T_OUT: H5.2 RELAY_T.4
RL_T_OUTA: H5.1 R38.1
RL_T_OUTB: H5.3 R47.1
RL_TEMP: R44.1 U18.7(VOA)
RST_W5500: R7.2 U7.37(RSTn) U13.30(IO37)
RTS: Q7.2(E) R29.2 UAT_TO_USB.24(RTS)
RX0: U13.36(RXD0) UAT_TO_USB.26(TXD)
RX_CAN0: U3.5(VOC) U11.2(RXCAN)
RX_CAN1: U3.6(VOD) U12.2(RXCAN)
RX_CAN_0B: U1.4(RXD) U3.11(VID)
RX_CAN_1B: U3.12(VIC) U4.4(RXD)
RXN: C10.2 U7.5(RXN)
RXP: C9.2 U7.6(RXP)
SCK: CARD.5(CLK(SCLK)) H8.6 U7.33(SCLK) U11.10(SCK) U12.10(SCK) U13.20(IO12)
SCL: DISPLAY.3 R21.1 U6.7(SCLB)
SCL_CAN: U14.6(SCL2) U25.10(SCL)
SCL_LV: R2.1 U6.2(SCLA) U13.39(IO1) U14.3(SCL1) U21.4(SCK) U24.6(SCL)
SDA: DISPLAY.4 R20.1 U6.6(SDAB)
SDA_CAN: U14.7(SDA2) U25.1(SDA)
SDA_LV: R19.1 U6.3(SDAA) U13.38(IO2) U14.2(SDA1) U21.3(SDI) U24.5(SDA)
TX0: U13.37(TXD0) UAT_TO_USB.25(RXD)
TX_CAN0: U3.3(VIA) U11.1(TXCAN)
TX_CAN1: U3.4(VIB) U12.1(TXCAN)
TX_CAN_0B: U1.1(TXD) U3.14(VOA)
TX_CAN_1B: U3.13(VOB) U4.1(TXD)
TXN: R10.2 T1.3 U7.1(TXN)
TXP: R11.2 T1.1 U7.2(TXP)
USB_DN: D3.2 UAT_TO_USB.5(D-) USB.2(D-)
USB_DP: D4.2 UAT_TO_USB.4(D+) USB.3(D+)
C6_2: C6.2 C23.2 D5.1(K) H6.1 Q1.3(D) U22.1
C33_1: C33.1 R33.2
C34_1: C34.1 R12.2
C35_1: C35.1 R15.2
C36_1: C36.1 R16.2
C37_2: C37.2 R12.1 R15.1 R16.1 R33.1
CAN0_1: CAN0.1 CAN1.1
CAN0_2: CAN0.2 RELAY_CAN0.3
CAN0_3: CAN0.3 RELAY_CAN0.6
CAN0_4: CAN0.4 CAN1.4
CAN1_2: CAN1.2 RELAY_CAN1.3
CAN1_3: CAN1.3 RELAY_CAN1.6
H1_2: H1.2 R34.2
LM_5V_7: LM_5V.7(VIN) P2.2
LM_5V_8: D14.1(K) L6.2 LM_5V.8(Output)
Net-(C2-1): C2.1 C19.1
Net-(C18-2): C18.2 R8.1 R9.1
Net-(C19-2): C19.2 R10.1 R11.1
R13_1: R13.1 U8.3(EM)
R14_2: Q2.1(B) R13.2 R14.2
R22_1: Q7.1(B) R22.1
R29_1: Q8.1(B) R29.1
R35_2: H2.2 R35.2
R43_2: Q6.1(B) R43.2 R44.2
R46_1: R46.1 R47.2
R51_2: Q3.1(B) Q4.1(B) R51.2 R52.2 R53.2
R54_2: C14.2 F1.2 L3.3 R54.2
R55_2: Q1.1(G) R55.2
RELAY_CAN0_2: RELAY_CAN0.2 RELAY_CAN1.2
RELAY_CAN0_4: D10.2 H1.3 RELAY_CAN0.4 U1.6(CANL)
RELAY_CAN0_5: D10.1 R34.1 RELAY_CAN0.5 U1.7(CANH)
RELAY_CAN0_7: RELAY_CAN0.7 RELAY_CAN1.7
RELAY_CAN0_8: D8.2(A) LED5.1(K) Q3.3(C) RELAY_CAN0.8
RELAY_CAN1_4: D11.2 H2.3 RELAY_CAN1.4 U4.6(CANL)
RELAY_CAN1_5: D11.1 R35.1 RELAY_CAN1.5 U4.7(CANH)
RELAY_CAN1_8: D9.2(A) LED6.1(K) Q4.3(C) RELAY_CAN1.8
RELAY_T_8: D7.2(A) LED4.1(K) Q6.3(C) RELAY_T.8
RJ1_1: RJ1.1 T1.16
RJ1_2: RJ1.2 T1.14
RJ1_3: RJ1.3 T1.11
RJ1_4: C34.2 RJ1.4 RJ1.5
RJ1_6: RJ1.6 T1.9
RJ1_7: C33.2 RJ1.7 RJ1.8
RL1_2: LED6.2(A) RL1.2
RL2_2: LED5.2(A) RL2.2
RL3_2: LED4.2(A) RL3.2
RL4_2: LED3.2(A) RL4.2
RL10_1: LED1.2(A) RL10.1
RLY1_2: RLY1.2 U5.3
RLY1_3: RLY1.3 U5.1
RLY1_4: D1.2(A) LED1.1(K) Q2.3(C) RLY1.4
RLY1_5: RLY1.5 U5.2
T1_6: C9.1 R9.2 T1.6
T1_8: C10.1 R8.2 T1.8
T1_10: C36.2 T1.10
T1_15: C35.2 T1.15
T_SENSOR_1: RELAY_T.3 T_SENSOR.1
T_SENSOR_2: RELAY_T.6 T_SENSOR.2
T_SENSOR_3: RELAY_T.7 T_SENSOR.3
T_SENSOR_4: RELAY_T.2 T_SENSOR.4
U7_10: R24.2 U7.10(EXRES1)
U7_20: C30.2 U7.20(TOCAP)
U7_22: C24.1 U7.22(1V2O)
U7_23: R25.2 U7.23(RSVD)
U7_25: R17.2 U7.25(LINKLED)
U7_27: R40.2 U7.27(ACTLED)
U7_30: C31.2 R23.2 U7.30(XI/CLKIN) X4.1(OSC1)
U7_31: C25.2 R23.1 U7.31(XO) X4.3(OSC2)
U7_38: R58.2 U7.38(RSVD)
U7_39: R57.2 U7.39(RSVD)
U7_40: R50.2 U7.40(RSVD)
U7_41: R48.2 U7.41(RSVD)
U7_42: R42.2 U7.42(RSVD)
U7_43: R41.2 U7.43(PMODE2)
U7_44: R28.2 U7.44(PMODE1)
U7_45: R27.2 U7.45(PMODE0)
U8_1: R59.2 U8.1(AN)
U11_5: C12.2 U11.5(OSC2) X2.3(OSC2)
U11_6: C1.2 U11.6(OSC1) X2.1(OSC1)
U15_4: C60.2 U15.4(BP)
U16_1: L3.1 U16.1(AC)
U16_2: L3.4 U16.2(AC)
U17_2: R38.2 U17.2
U25_9: C62.2 U25.9(V+)
UAT_TO_USB_8: C11.2 R1.2 R3.2 UAT_TO_USB.8(VBUS)
UAT_TO_USB_9: R32.1 UAT_TO_USB.9(RSTb)
X3_1: C54.2 U12.6(OSC1) X3.1(OSC1)
X3_3: C55.2 U12.5(OSC2) X3.3(OSC2)

Not connected (* = marked no-connect by the designer): CARD 1(DAT2(RSV))* 8(DAT1(RSV))* 9(CD)*; H1 1*; H2 1*; LED2 2(DOUT)*; LM_5V 1(NC)* 2(NC)* 3(NC)*; R38 3*; R45 3*; R47 3*; R49 3*; T1 4* 5* 12* 13*; U7 7(DNC)* 12(NC)* 13(NC)* 18(VBG)* 24(SPDLED)* 26(DUPLED)* 46(NC)* 47(NC)*; U11 3(CLKO/SOF)* 8(INT1#/GPIO1)* 9(INT0#/GPIO0/XSTBY)*; U12 3(CLKO/SOF)* 8(INT1#/GPIO1)* 9(INT0#/GPIO0/XSTBY)*; U13 12(IO8)* 13(IO19)* 14(IO20)* 15(IO3)* 16(IO46)* 17(IO9)* 26(IO45)*; U25 6(RH)*; UAT_TO_USB 1(DCD)* 2(RI/CLK)* 10(NC)* 11(SUSPENDb)* 12(SUSPEND)* 13(CHREN)* 14(CHR1)* 15(CHR0)* 16(GPIO.3/WAKEUP)* 17(GPIO.2/RS485)* 18(GPIO.1/RXT)* 19(GPIO.0/TXT)* 20(GPIO.6)* 21(GPIO.5)* 22(GPIO.4)* 23(CTS)* 27(DSR)*

## Notes on the sheet
- SIGNAL_AND_POWER_ISOLATION
- CONNECTORS
- USB
- DIGITAL_POTENTIOMETER
- 0x28
- 516 ohm
- 947,35 ohm
- PT1000
- USB_TO_UART
- AUTO_RESET
- 1362 ohm
- 1451 ohm
- KTY
- STARTUP_RELAY
- RJ45
- TEMP_HUM_BARO_SEN
- 0X76
- GND
- EEPROM_32KB
- Write 0xA0
- ACDC_CONVERTER_5V
- CAN
- Read 0xA1
- SD_CARD
- SPEP_DOWN_CONVERTER_5V
- LINEAR_VOLTAGE_REG_3V3
- W5500
- STATUS_LEDS
- 5V_MANAGEMENT_AND_FILTER
- I2C_LEVEL_SHIFTER
